# EAGLE schematic Overcurrent Protection (EAGLE 7.6.0)
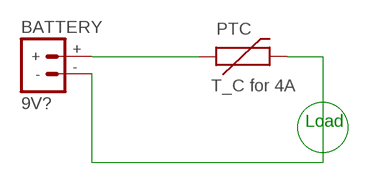
[diagram p0: schematic, sheet 1]

## Parts
BATTERY  9V?  BATTERY_CONNDEANS  [DEANS]
PTC  T_C for 4A  PTCPTH  [PTC]

## Nets
N$1: BATTERY.+ PTC.P$1
N$2: BATTERY.- PTC.P$2

## Notes on the sheet
- Load

## Library data of the parts
BATTERY = SparkFun-Connectors:BATTERY_CONN: Various footprints for battery connectors
PTC = SparkFun-PowerIC:PTC: Resettable Fuse PTC Resettable Fuse. Spark Fun Electronics SKU : COM-08357